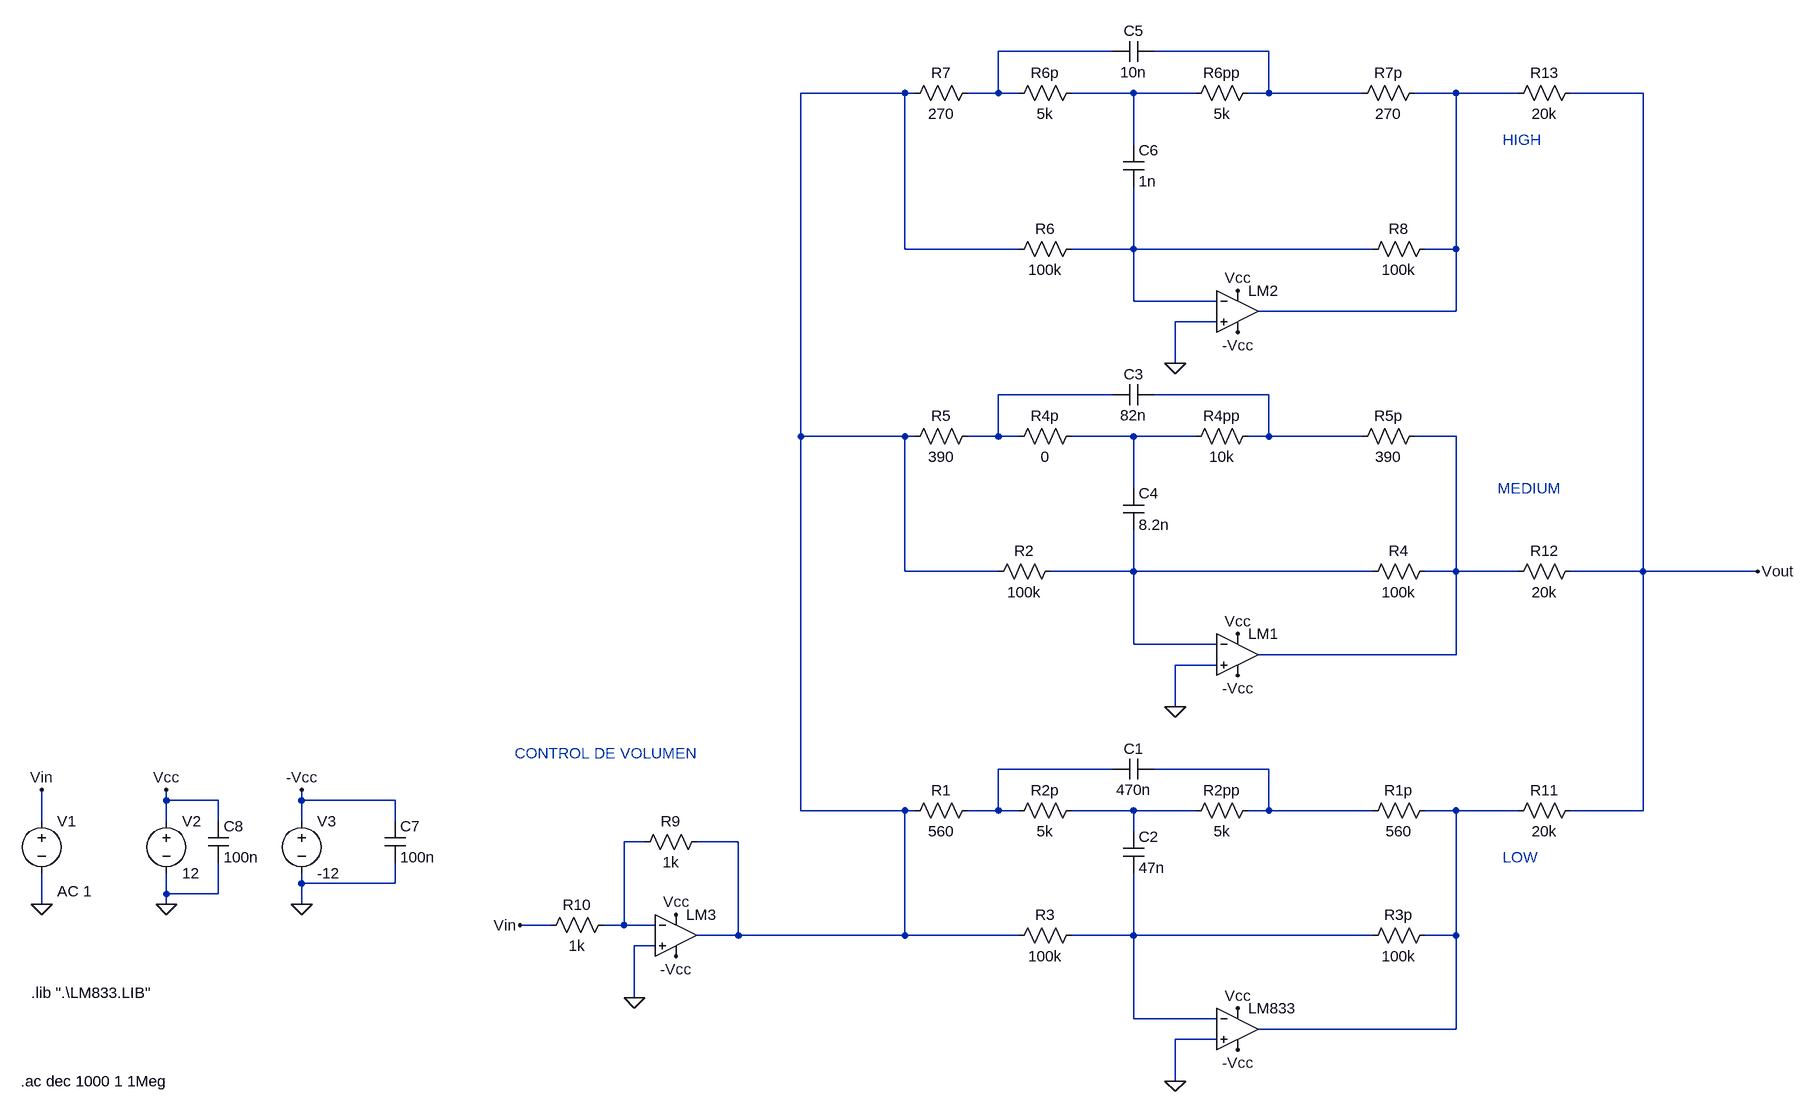
[diagram p0: schematic Circuito completo.asc]
Circuito completo.asc, the LTspice schematic file:
Version 4
SHEET 1 3284 680
WIRE 1520 -1120 1344 -1120
WIRE 1760 -1120 1584 -1120
WIRE 1200 -1056 1040 -1056
WIRE 1216 -1056 1200 -1056
WIRE 1344 -1056 1344 -1120
WIRE 1344 -1056 1296 -1056
WIRE 1376 -1056 1344 -1056
WIRE 1552 -1056 1456 -1056
WIRE 1648 -1056 1552 -1056
WIRE 1760 -1056 1760 -1120
WIRE 1760 -1056 1728 -1056
WIRE 1904 -1056 1760 -1056
WIRE 2048 -1056 1984 -1056
WIRE 2144 -1056 2048 -1056
WIRE 2336 -1056 2224 -1056
WIRE 1552 -976 1552 -1056
WIRE 1200 -816 1200 -1056
WIRE 1376 -816 1200 -816
WIRE 1552 -816 1552 -912
WIRE 1552 -816 1456 -816
WIRE 1920 -816 1552 -816
WIRE 2048 -816 2048 -1056
WIRE 2048 -816 2000 -816
WIRE 1552 -736 1552 -816
WIRE 1680 -736 1552 -736
WIRE 2048 -720 2048 -816
WIRE 2048 -720 1744 -720
WIRE 1680 -704 1616 -704
WIRE 1616 -640 1616 -704
WIRE 1520 -592 1344 -592
WIRE 1760 -592 1584 -592
WIRE 1040 -528 1040 -1056
WIRE 1200 -528 1040 -528
WIRE 1216 -528 1200 -528
WIRE 1344 -528 1344 -592
WIRE 1344 -528 1296 -528
WIRE 1376 -528 1344 -528
WIRE 1552 -528 1456 -528
WIRE 1648 -528 1552 -528
WIRE 1760 -528 1760 -592
WIRE 1760 -528 1728 -528
WIRE 1904 -528 1760 -528
WIRE 2048 -528 1984 -528
WIRE 1552 -448 1552 -528
WIRE 1200 -320 1200 -528
WIRE 1344 -320 1200 -320
WIRE 1552 -320 1552 -384
WIRE 1552 -320 1424 -320
WIRE 1920 -320 1552 -320
WIRE 2048 -320 2048 -528
WIRE 2048 -320 2000 -320
WIRE 2144 -320 2048 -320
WIRE 2336 -320 2336 -1056
WIRE 2336 -320 2224 -320
WIRE 2512 -320 2336 -320
WIRE 1552 -208 1552 -320
WIRE 1680 -208 1552 -208
WIRE 2048 -192 2048 -320
WIRE 2048 -192 1744 -192
WIRE 1680 -176 1616 -176
WIRE 1616 -112 1616 -176
WIRE 1520 -16 1344 -16
WIRE 1760 -16 1584 -16
WIRE 64 32 64 16
WIRE 144 32 64 32
WIRE 272 32 272 16
WIRE 416 32 272 32
WIRE 1040 48 1040 -528
WIRE 1200 48 1040 48
WIRE 1216 48 1200 48
WIRE 1344 48 1344 -16
WIRE 1344 48 1296 48
WIRE 1376 48 1344 48
WIRE 1552 48 1456 48
WIRE 1648 48 1552 48
WIRE 1760 48 1760 -16
WIRE 1760 48 1728 48
WIRE 1920 48 1760 48
WIRE 2048 48 2000 48
WIRE 2144 48 2048 48
WIRE 2336 48 2336 -320
WIRE 2336 48 2224 48
WIRE -128 64 -128 16
WIRE 64 64 64 32
WIRE 144 64 144 32
WIRE 272 64 272 32
WIRE 416 64 416 32
WIRE 1552 80 1552 48
WIRE 800 96 768 96
WIRE 944 96 880 96
WIRE 272 160 272 144
WIRE 416 160 416 128
WIRE 416 160 272 160
WIRE 64 176 64 144
WIRE 144 176 144 128
WIRE 144 176 64 176
WIRE -128 192 -128 144
WIRE 64 192 64 176
WIRE 272 192 272 160
WIRE 656 224 608 224
WIRE 768 224 768 96
WIRE 768 224 736 224
WIRE 816 224 768 224
WIRE 944 240 944 96
WIRE 944 240 880 240
WIRE 1200 240 1200 48
WIRE 1200 240 944 240
WIRE 1376 240 1200 240
WIRE 1552 240 1552 144
WIRE 1552 240 1456 240
WIRE 1920 240 1552 240
WIRE 2048 240 2048 48
WIRE 2048 240 2000 240
WIRE 816 256 784 256
WIRE 784 336 784 256
WIRE 1552 368 1552 240
WIRE 1680 368 1552 368
WIRE 2048 384 2048 240
WIRE 2048 384 1744 384
WIRE 1680 400 1616 400
WIRE 1616 464 1616 400
FLAG -128 192 0
FLAG 64 192 0
FLAG 272 192 0
FLAG 1616 464 0
FLAG -128 16 Vin
FLAG 64 16 Vcc
FLAG 1712 352 Vcc
FLAG 272 16 -Vcc
FLAG 1712 416 -Vcc
FLAG 1616 -112 0
FLAG 1712 -224 Vcc
FLAG 1712 -160 -Vcc
FLAG 1616 -640 0
FLAG 1712 -752 Vcc
FLAG 1712 -688 -Vcc
FLAG 2512 -320 Vout
FLAG 608 224 Vin
FLAG 784 336 0
FLAG 848 272 -Vcc
FLAG 848 208 Vcc
SYMBOL res 1472 32 R90
WINDOW 0 0 56 VBottom 2
WINDOW 3 32 56 VTop 2
SYMATTR InstName R2p
SYMATTR Value 5k
SYMBOL res 1744 32 R90
WINDOW 0 0 56 VBottom 2
WINDOW 3 32 56 VTop 2
SYMATTR InstName R2pp
SYMATTR Value 5k
SYMBOL res 1472 224 R90
WINDOW 0 0 56 VBottom 2
WINDOW 3 32 56 VTop 2
SYMATTR InstName R3
SYMATTR Value 100k
SYMBOL res 2016 224 R90
WINDOW 0 0 56 VBottom 2
WINDOW 3 32 56 VTop 2
SYMATTR InstName R3p
SYMATTR Value 100k
SYMBOL cap 1536 80 R0
SYMATTR InstName C2
SYMATTR Value 47n
SYMBOL cap 1584 -32 R90
WINDOW 0 0 32 VBottom 2
WINDOW 3 32 32 VTop 2
SYMATTR InstName C1
SYMATTR Value 470n
SYMBOL res 1312 32 R90
WINDOW 0 0 56 VBottom 2
WINDOW 3 32 56 VTop 2
SYMATTR InstName R1
SYMATTR Value 560
SYMBOL res 2016 32 R90
WINDOW 0 0 56 VBottom 2
WINDOW 3 32 56 VTop 2
SYMATTR InstName R1p
SYMATTR Value 560
SYMBOL voltage -128 48 R0
WINDOW 123 24 124 Left 2
WINDOW 39 0 0 Left 0
SYMATTR Value2 AC 1
SYMATTR InstName V1
SYMATTR Value ""
SYMBOL voltage 64 48 R0
SYMATTR InstName V2
SYMATTR Value 12
SYMBOL voltage 272 48 R0
SYMATTR InstName V3
SYMATTR Value -12
SYMBOL res 1472 -544 R90
WINDOW 0 0 56 VBottom 2
WINDOW 3 32 56 VTop 2
SYMATTR InstName R4p
SYMATTR Value 0
SYMBOL res 1744 -544 R90
WINDOW 0 0 56 VBottom 2
WINDOW 3 32 56 VTop 2
SYMATTR InstName R4pp
SYMATTR Value 10k
SYMBOL cap 1584 -608 R90
WINDOW 0 0 32 VBottom 2
WINDOW 3 32 32 VTop 2
SYMATTR InstName C3
SYMATTR Value 82n
SYMBOL res 1312 -544 R90
WINDOW 0 0 56 VBottom 2
WINDOW 3 32 56 VTop 2
SYMATTR InstName R5
SYMATTR Value 390
SYMBOL res 2000 -544 R90
WINDOW 0 0 56 VBottom 2
WINDOW 3 32 56 VTop 2
SYMATTR InstName R5p
SYMATTR Value 390
SYMBOL res 1472 -1072 R90
WINDOW 0 0 56 VBottom 2
WINDOW 3 32 56 VTop 2
SYMATTR InstName R6p
SYMATTR Value 5k
SYMBOL res 1744 -1072 R90
WINDOW 0 0 56 VBottom 2
WINDOW 3 32 56 VTop 2
SYMATTR InstName R6pp
SYMATTR Value 5k
SYMBOL cap 1584 -1136 R90
WINDOW 0 0 32 VBottom 2
WINDOW 3 32 32 VTop 2
SYMATTR InstName C5
SYMATTR Value 10n
SYMBOL res 1312 -1072 R90
WINDOW 0 0 56 VBottom 2
WINDOW 3 32 56 VTop 2
SYMATTR InstName R7
SYMATTR Value 270
SYMBOL res 2000 -1072 R90
WINDOW 0 0 56 VBottom 2
WINDOW 3 32 56 VTop 2
SYMATTR InstName R7p
SYMATTR Value 270
SYMBOL cap 1536 -448 R0
SYMATTR InstName C4
SYMATTR Value 8.2n
SYMBOL cap 1536 -976 R0
SYMATTR InstName C6
SYMATTR Value 1n
SYMBOL res 1440 -336 R90
WINDOW 0 0 56 VBottom 2
WINDOW 3 32 56 VTop 2
SYMATTR InstName R2
SYMATTR Value 100k
SYMBOL res 2016 -336 R90
WINDOW 0 0 56 VBottom 2
WINDOW 3 32 56 VTop 2
SYMATTR InstName R4
SYMATTR Value 100k
SYMBOL res 1472 -832 R90
WINDOW 0 0 56 VBottom 2
WINDOW 3 32 56 VTop 2
SYMATTR InstName R6
SYMATTR Value 100k
SYMBOL res 2016 -832 R90
WINDOW 0 0 56 VBottom 2
WINDOW 3 32 56 VTop 2
SYMATTR InstName R8
SYMATTR Value 100k
SYMBOL Opamps\\UniversalOpamp2 1712 384 R0
SYMATTR InstName LM833
SYMBOL Opamps\\UniversalOpamp2 1712 -192 R0
SYMATTR InstName LM1
SYMBOL Opamps\\UniversalOpamp2 1712 -720 R0
SYMATTR InstName LM2
SYMBOL cap 400 64 R0
SYMATTR InstName C7
SYMATTR Value 100n
SYMBOL cap 128 64 R0
SYMATTR InstName C8
SYMATTR Value 100n
SYMBOL res 896 80 R90
WINDOW 0 0 56 VBottom 2
WINDOW 3 32 56 VTop 2
SYMATTR InstName R9
SYMATTR Value 1k
SYMBOL res 752 208 R90
WINDOW 0 0 56 VBottom 2
WINDOW 3 32 56 VTop 2
SYMATTR InstName R10
SYMATTR Value 1k
SYMBOL Opamps\\UniversalOpamp2 848 240 R0
SYMATTR InstName LM3
SYMBOL res 2240 32 R90
WINDOW 0 0 56 VBottom 2
WINDOW 3 32 56 VTop 2
SYMATTR InstName R11
SYMATTR Value 20k
SYMBOL res 2240 -336 R90
WINDOW 0 0 56 VBottom 2
WINDOW 3 32 56 VTop 2
SYMATTR InstName R12
SYMATTR Value 20k
SYMBOL res 2240 -1072 R90
WINDOW 0 0 56 VBottom 2
WINDOW 3 32 56 VTop 2
SYMATTR InstName R13
SYMATTR Value 20k
TEXT -144 328 Left 2 !.lib ".\\LM833.LIB"
TEXT -160 464 Left 2 !.ac dec 1000 1 1Meg
TEXT 2120 120 Left 2 ;LOW
TEXT 2112 -448 Left 2 ;MEDIUM
TEXT 2120 -984 Left 2 ;HIGH
TEXT 600 -40 Left 2 ;CONTROL DE VOLUMEN

The netlist it stands for:
* Circuito completo.asc
R2p N014 N012 5k
R2pp N013 N014 5k
R3 N017 N003 100k
R3p N015 N017 100k
C2 N014 N017 47n
C1 N013 N012 470n
R1 N012 N003 560
R1p N015 N013 560
V1 Vin 0 AC 1
V2 Vcc 0 12
V3 -Vcc 0 -12
R4p N009 N007 0
R4pp N008 N009 10k
C3 N008 N007 82n
R5 N007 N003 390
R5p N010 N008 390
R6p N004 N001 5k
R6pp N002 N004 5k
C5 N002 N001 10n
R7 N001 N003 270
R7p N005 N002 270
C4 N009 N011 8.2n
C6 N004 N006 1n
R2 N011 N003 100k
R4 N010 N011 100k
R6 N006 N003 100k
R8 N005 N006 100k
XLM833 0 N017 Vcc -Vcc N015 level.2 Avol=1Meg GBW=10Meg Slew=10Meg ilimit=25m rail=0 Vos=0 phimargin=45 en=0 enk=0 in=0 ink=0 Rin=500Meg  ; pins IN+ IN- V+ V- OUT
XLM1 0 N011 Vcc -Vcc N010 level.2 Avol=1Meg GBW=10Meg Slew=10Meg ilimit=25m rail=0 Vos=0 phimargin=45 en=0 enk=0 in=0 ink=0 Rin=500Meg  ; pins IN+ IN- V+ V- OUT
XLM2 0 N006 Vcc -Vcc N005 level.2 Avol=1Meg GBW=10Meg Slew=10Meg ilimit=25m rail=0 Vos=0 phimargin=45 en=0 enk=0 in=0 ink=0 Rin=500Meg  ; pins IN+ IN- V+ V- OUT
C7 -Vcc 0 100n
C8 Vcc 0 100n
R9 N003 N016 1k
R10 N016 Vin 1k
XLM3 0 N016 Vcc -Vcc N003 level.2 Avol=1Meg GBW=10Meg Slew=10Meg ilimit=25m rail=0 Vos=0 phimargin=45 en=0 enk=0 in=0 ink=0 Rin=500Meg  ; pins IN+ IN- V+ V- OUT
R11 Vout N015 20k
R12 Vout N010 20k
R13 Vout N005 20k
.lib ".\LM833.LIB"
.ac dec 1000 1 1Meg
* LOW
* MEDIUM
* HIGH
* CONTROL DE VOLUMEN
.lib UniversalOpamps2.sub
.backanno
.end